# EAGLE schematic Digitalteil_Pic (EAGLE 4.15)
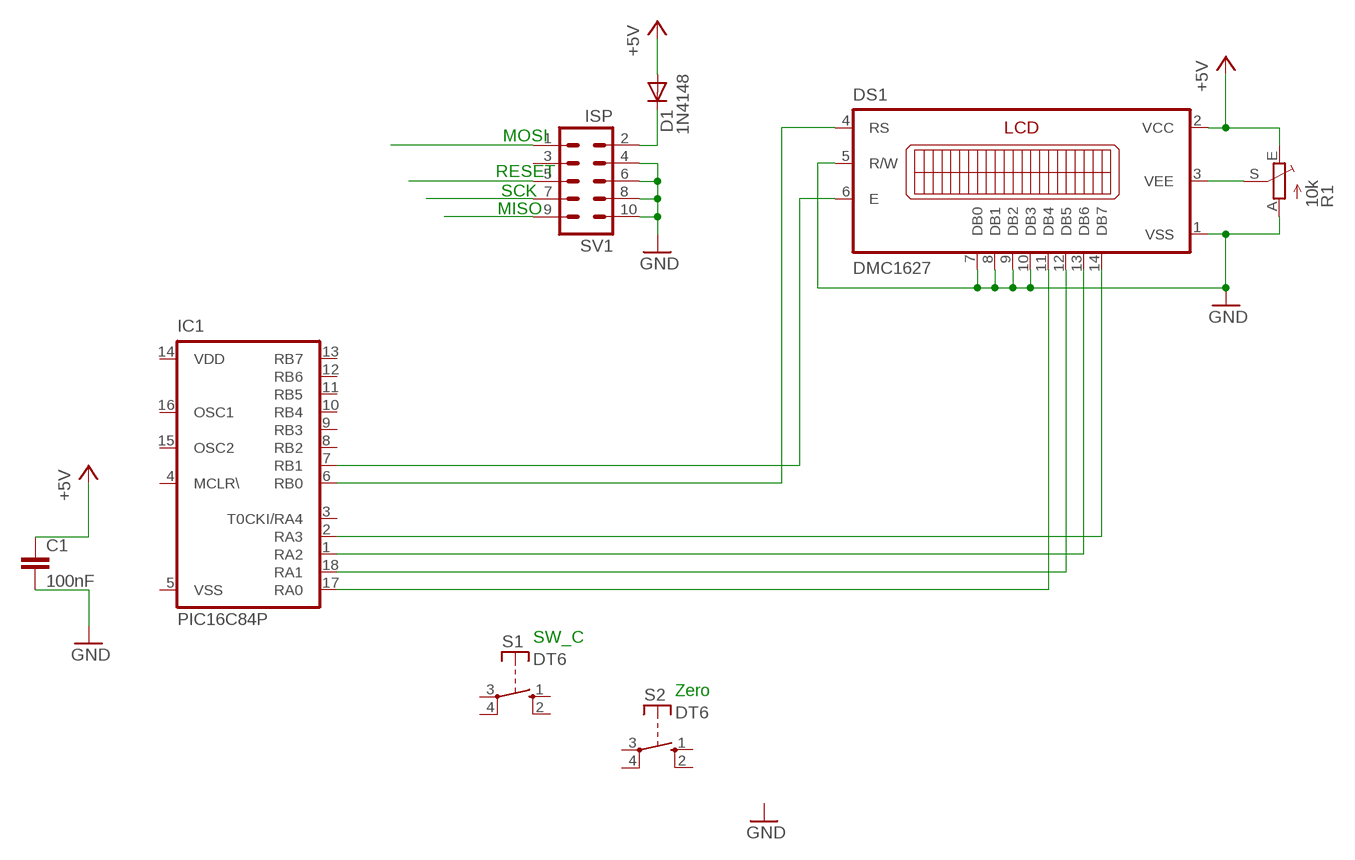
[diagram p0: schematic, sheet 1]

## Parts
C1  100nF  C-EU025-025X050  [C025-025X050]
D1  1N4148  [DO35-10]
DS1  DMC1627  [DMC1627]
IC1  PIC16C84P  [DIL18]
R1  10k  TRIM_EU-S75P  [S75P]
S1  DT6  [DT6]
S2  DT6  [DT6]
SV1  ISP  ML10  [ML10]

## Nets
+5V: C1.1 D1.A DS1.2(VCC) R1.E
GND: C1.2 DS1.1(VSS) DS1.5(R/W) DS1.7(DB0) DS1.8(DB1) DS1.9(DB2) DS1.10(DB3) R1.A SV1.4 SV1.6 SV1.8 SV1.10
N$1: DS1.14(DB7) IC1.2(RA3)
N$2: DS1.13(DB6) IC1.1(RA2)
N$3: DS1.11(DB4) IC1.17(RA0)
N$4: DS1.12(DB5)
N$5: SV1.1
N$6: SV1.5
N$10: SV1.7
N$11: SV1.9
N$12: DS1.6(E) IC1.7(RB1)
N$13: DS1.4(RS) IC1.6(RB0)
N$14: DS1.3(VEE) R1.S
N$15: D1.C SV1.2
Unconnected: IC1.3(T0CKI/RA4) IC1.4(MCLR\) IC1.8(RB2) IC1.9(RB3) IC1.10(RB4) IC1.11(RB5) IC1.12(RB6) IC1.13(RB7) IC1.15(OSC2) IC1.16(OSC1) IC1.18(RA1) S1.1(S) S1.2(S) S1.3(P) S1.4(P) S2.1(S) S2.2(S) S2.3(P) S2.4(P) SV1.3

## Notes on the sheet
- MOSI
- RESET
- SCK
- MISO
- SW_C
- Zero

## Power pins joined to a net without a drawn wire
VDD: IC1.14(VDD)
VSS: IC1.5(VSS)

## Library data of the parts
C1 = rcl:C-EU: CAPACITOR, European symbol
D1 = diode:1N4148: DIODE high speed (Philips)
DS1 = display-lcd:DMC1627: LCD DISPLAY Optrex, 16 characters x 2 Lines
IC1 = microchip:PIC16C84: MICROCONTROLLER EPROM/ROM-based
R1 = pot:TRIM_EU-: POTENTIOMETER
S1 S2 = switch-misc:DT: ITT SWITCH
SV1 = con-harting-ml:ML10: HARTING